# EAGLE design face_tracking_drone_onflight (EAGLE 9.3.0)
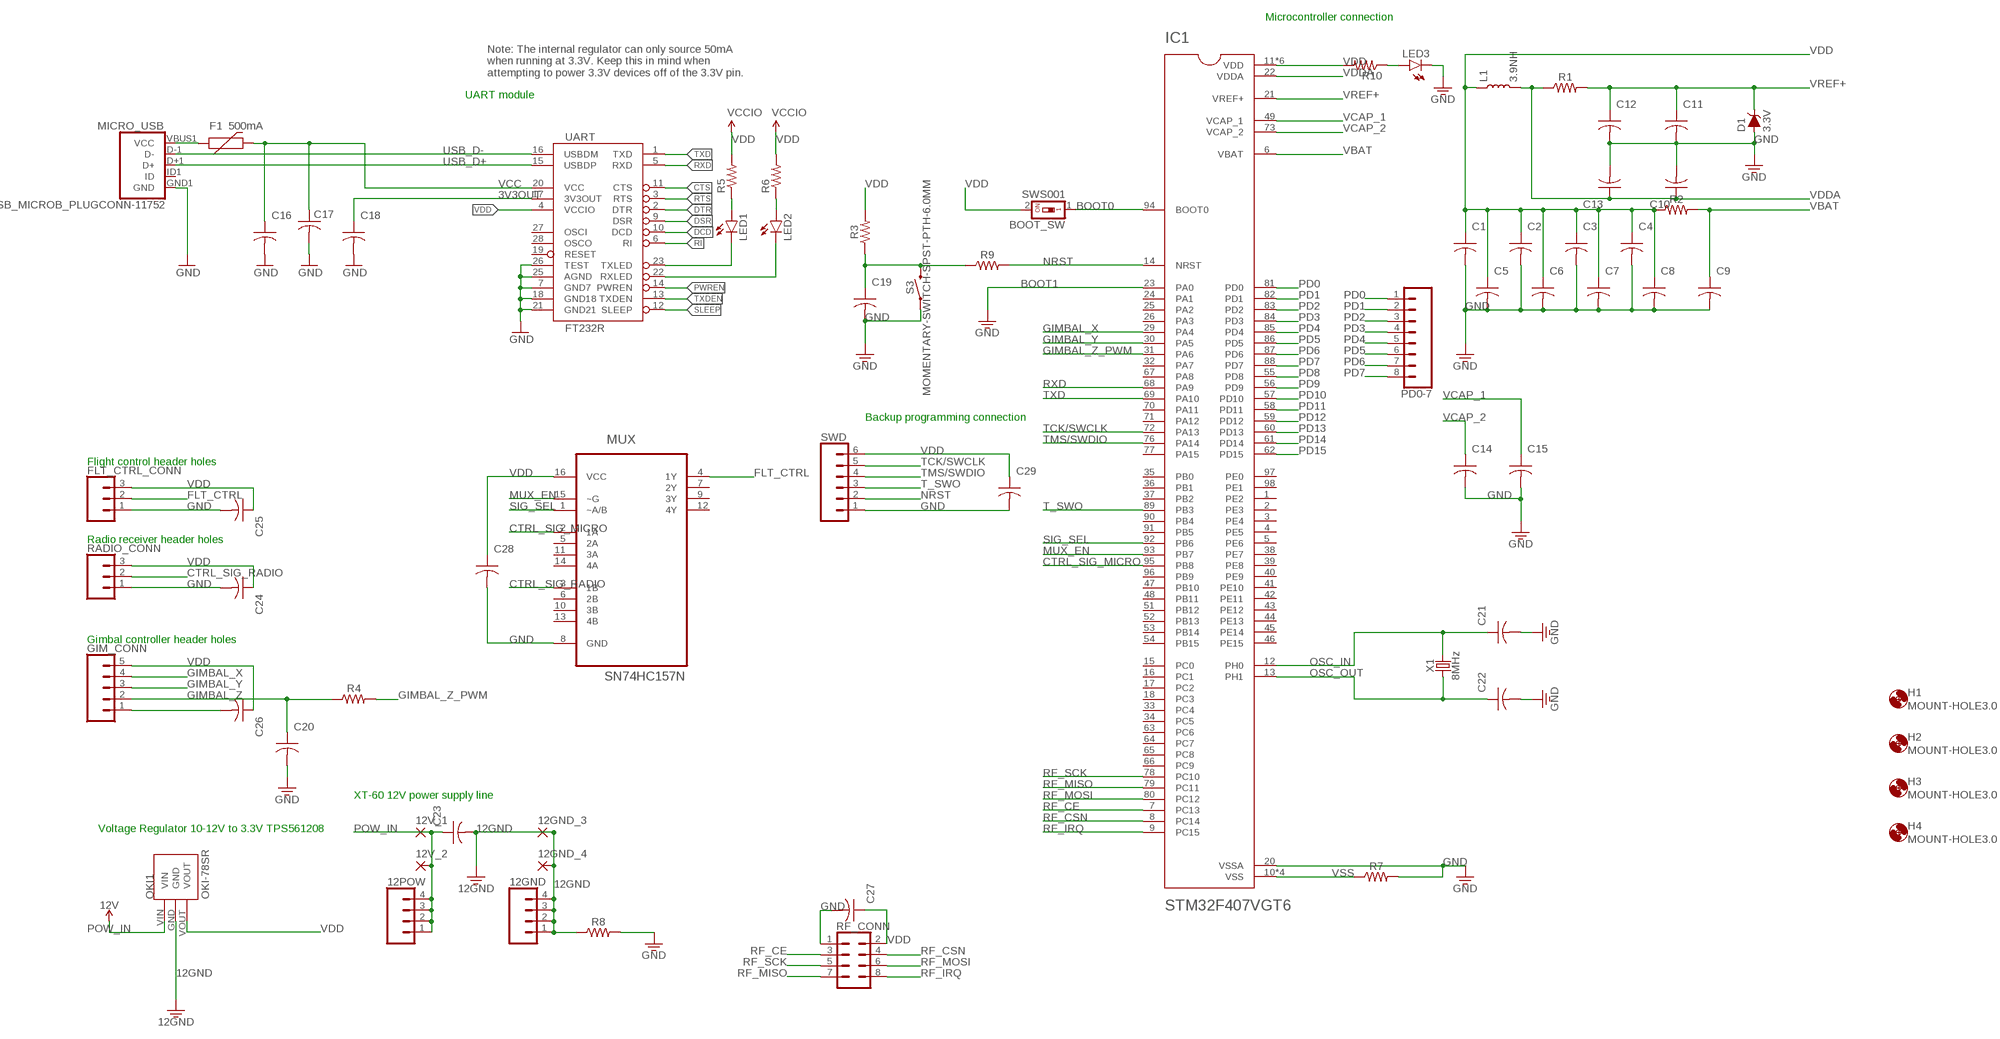
[diagram p0: schematic, sheet 1]

## Parts
12GND  CONN_04  [1X04]
12GND_3  3,81/1,4  [3,81/1,4]
12GND_4  3,81/1,4  [3,81/1,4]
12POW  CONN_04  [1X04]
12V_1  3,81/1,4  [3,81/1,4]
12V_2  3,81/1,4  [3,81/1,4]
BOOT_SW  SWS001  [SMS-001]
C1  0.1uF  C-USC0805  [C0805]
C2  0.1uF  C-USC0805  [C0805]
C3  0.1uF  C-USC0805  [C0805]
C4  0.1uF  C-USC0805  [C0805]
C5  0.1uF  C-USC0805  [C0805]
C6  0.1uF  C-USC0805  [C0805]
C7  0.1uF  C-USC0805  [C0805]
C8  0.1uF  C-USC0805  [C0805]
C9  0.1uF  C-USC0805  [C0805]
C10  0.1uF  C-USC0805  [C0805]
C11  0.1uF  C-USC0805  [C0805]
C12  1uF  C-USC0805  [C0805]
C13  1uF  C-USC0805  [C0805]
C14  2.2uF  C-USC0805  [C0805]
C15  2.2uF  C-USC0805  [C0805]
C16  0.1uF  C-USC0805  [C0805]
C17  10uF  C-USC0805  [C0805]
C18  0.1uF  C-USC0805  [C0805]
C19  2.2uF  C-USC0805  [C0805]
C20  0.1uF  C-USC0805  [C0805]
C21  20pF  C-USC0805  [C0805]
C22  20pF  C-USC0805  [C0805]
C23  0.1uF  C-USC0805  [C0805]
C24  0.1uF  C-USC0805  [C0805]
C25  0.1uF  C-USC0805  [C0805]
C26  0.1uF  C-USC0805  [C0805]
C27  0.1uF  C-USC0805  [C0805]
C28  0.1uF  C-USC0805  [C0805]
C29  0.1uF  C-USC0805  [C0805]
D1  3.3V  DIODE-ZENER-BZT52C3V6S  [SOD-323]
F1  500mA  PTCSMD  [PTC-1206]
FLT_CTRL_CONN  CONN_03  [1X03]
GIM_CONN  CONN_05  [1X05]
H1  MOUNT-HOLE3.0  [3,0]
H2  MOUNT-HOLE3.0  [3,0]
H3  MOUNT-HOLE3.0  [3,0]
H4  MOUNT-HOLE3.0  [3,0]
IC1  STM32F407VGT6  [QFP50P1600X1600X160-100N]
L1  3.9NH  INDUCTOR-0402-3.9NH  [0402]
LED1  Red  LEDCHIP-LED0805  [CHIP-LED0805]
LED2  Green  LEDCHIP-LED0805  [CHIP-LED0805]
LED3  Green  LEDCHIP-LED0805  [CHIP-LED0805]
MICRO_USB  USB_MICROB_PLUGCONN-11752  [USB-B-MICRO-SMD_V03]
MUX  SN74HC157N  [DIP254P762X508-16]
OKI1  OKI-78SR  [OKI-78SR]
PD0-7  CONN_08"  [1X08]
R1  0  R-US_M0805  [M0805]
R2  0  R-US_M0805  [M0805]
R3  10k  R-US_M0805  [M0805]
R4  100K  R-US_M0805  [M0805]
R5  330  R-US_M0805  [M0805]
R6  330  R-US_M0805  [M0805]
R7  0  R-US_M0805  [M0805]
R8  10M  R-US_M0805  [M0805]
R9  100  R-US_M0805  [M0805]
R10  330  R-US_M0805  [M0805]
RADIO_CONN  CONN_03  [1X03]
RF_CONN  CONN_04X2  [2X4]
S3  MOMENTARY-SWITCH-SPST-PTH-6.0MM  [TACTILE_SWITCH_PTH_6.0MM]
SWD  CONN_06SILK_FEMALE_PTH  [1X06]
UART  FT232R  FT232RLSSOP  [SSOP28DB]
X1  8MHz  CRYSTALPTH-HC49UV  [HC49U]

## Nets
3V3OUT [3.3power]: C18.1 UART.17(3V3OUT)
12GND [12power]: 12GND.1 12GND.2 12GND.3 12GND.4 12GND_3.1(P) 12GND_4.1(P) C23.2 OKI1.GND R8.1
BOOT0: BOOT_SW.1 IC1.94(BOOT0)
BOOT1: IC1.23(PA0) ; supply symbol labelled GND
CTRL_SIG_MICRO: IC1.95(PB8) MUX.2(1A)
CTRL_SIG_RADIO: MUX.3(1B) RADIO_CONN.2
CTS: UART.11(CTS)
DCD: UART.10(DCD)
DSR: UART.9(DSR)
DTR: UART.2(DTR)
FLT_CTRL: FLT_CTRL_CONN.2 MUX.4(1Y)
GIMBAL_X: GIM_CONN.4 IC1.29(PA4)
GIMBAL_Y: GIM_CONN.3 IC1.30(PA5)
GIMBAL_Z: C20.1 GIM_CONN.2 R4.1
GIMBAL_Z_PWM: IC1.31(PA6) R4.2
GND [3.3power]: C1.2 C2.2 C3.2 C4.2 C5.2 C6.2 C7.2 C8.2 C9.2 C10.2 C11.2 C12.2 C13.2 C14.2 C15.2 C16.2 C17.2 C18.2 C19.2 C20.2 C21.2 C22.2 C24.2 C25.2 C26.2 C27.2 C28.2 C29.2 D1.A FLT_CTRL_CONN.1 GIM_CONN.1 IC1.20(VSSA) LED3.C MICRO_USB.GND1(GND) MUX.8(GND) R7.2 R8.2 RADIO_CONN.1 RF_CONN.1 S3.1 SWD.1 UART.7(GND7) UART.18(GND18) UART.21(GND21) UART.25(AGND) UART.26(TEST)
MUX_EN: IC1.93(PB7) MUX.15(~G)
N$1: LED1.A R5.1
N$2: LED3.A R10.1
N$4: LED2.A R6.1
N$5: F1.1 MICRO_USB.VBUS1(VCC)
N$6: C19.1 R3.1 R9.1 S3.3
NRST: IC1.14(NRST) R9.2 SWD.2
OSC_IN: C21.1 IC1.12(PH0) X1.2
OSC_OUT: C22.1 IC1.13(PH1) X1.1
PD0: IC1.81(PD0) PD0-7.1
PD1: IC1.82(PD1) PD0-7.2
PD2: IC1.83(PD2) PD0-7.3
PD3: IC1.84(PD3) PD0-7.4
PD4: IC1.85(PD4) PD0-7.5
PD5: IC1.86(PD5) PD0-7.6
PD6: IC1.87(PD6) PD0-7.7
PD7: IC1.88(PD7) PD0-7.8
PD8: IC1.55(PD8)
PD9: IC1.56(PD9)
PD10: IC1.57(PD10)
PD11: IC1.58(PD11)
PD12: IC1.59(PD12)
PD13: IC1.60(PD13)
PD14: IC1.61(PD14)
PD15: IC1.62(PD15)
POW_IN [12power]: 12POW.1 12POW.2 12POW.3 12POW.4 12V_1.1(P) 12V_2.1(P) C23.1 OKI1.VIN ; supply symbol labelled 12V
PWREN: UART.14(PWREN)
RF_CE: IC1.7(PC13) RF_CONN.3
RF_CSN: IC1.8(PC14) RF_CONN.4
RF_IRQ: IC1.9(PC15) RF_CONN.8
RF_MISO: IC1.79(PC11) RF_CONN.7
RF_MOSI: IC1.80(PC12) RF_CONN.6
RF_SCK: IC1.78(PC10) RF_CONN.5
RI: UART.6(RI)
RTS: UART.3(RTS)
RXD: IC1.68(PA9) UART.5(RXD)
RXLED: LED2.C UART.22(RXLED)
SIG_SEL: IC1.92(PB6) MUX.1(~A/B)
SLEEP: UART.12(SLEEP)
T_SWO: IC1.89(PB3) SWD.3
TCK/SWCLK: IC1.72(PA13) SWD.5
TMS/SWDIO: IC1.76(PA14) SWD.4
TXD: IC1.69(PA10) UART.1(TXD)
TXDEN: UART.13(TXDEN)
TXLED: LED1.C UART.23(TXLED)
USB_D+: MICRO_USB.D+1(D+) UART.15(USBDP)
USB_D-: MICRO_USB.D-1(D-) UART.16(USBDM)
VBAT: C9.1 IC1.6(VBAT) R2.2
VCAP_1: C15.1 IC1.49(VCAP_1)
VCAP_2: C14.1 IC1.73(VCAP_2)
VCC [3.3power]: C16.1 C17.1 F1.2 UART.20(VCC)
VDD [3.3power]: BOOT_SW.2 C1.1 C2.1 C3.1 C4.1 C5.1 C6.1 C7.1 C8.1 C24.1 C25.1 C26.1 C27.1 C28.1 C29.1 FLT_CTRL_CONN.3 GIM_CONN.5 IC1.11(VDD) IC1.19(VDD) IC1.28(VDD) IC1.50(VDD) IC1.75(VDD) IC1.100(VDD) L1.1 MUX.16(VCC) OKI1.VOUT R2.1 R3.2 R5.2 R6.2 R10.2 RADIO_CONN.3 RF_CONN.2 SWD.6 UART.4(VCCIO) ; supply symbol labelled VCCIO
VDDA: C10.1 C13.1 IC1.22(VDDA) L1.2 R1.1
VREF+: C11.1 C12.1 D1.C IC1.21(VREF+) R1.2
VSS: IC1.10(VSS) IC1.27(VSS) IC1.74(VSS) IC1.99(VSS) R7.1
Unconnected: IC1.1(PE2) IC1.2(PE3) IC1.3(PE4) IC1.4(PE5) IC1.5(PE6) IC1.15(PC0) IC1.16(PC1) IC1.17(PC2) IC1.18(PC3) IC1.24(PA1) IC1.25(PA2) IC1.26(PA3) IC1.32(PA7) IC1.33(PC4) IC1.34(PC5) IC1.35(PB0) IC1.36(PB1) IC1.37(PB2) IC1.38(PE7) IC1.39(PE8) IC1.40(PE9) IC1.41(PE10) IC1.42(PE11) IC1.43(PE12) IC1.44(PE13) IC1.45(PE14) IC1.46(PE15) IC1.47(PB10) IC1.48(PB11) IC1.51(PB12) IC1.52(PB13) IC1.53(PB14) IC1.54(PB15) IC1.63(PC6) IC1.64(PC7) IC1.65(PC8) IC1.66(PC9) IC1.67(PA8) IC1.70(PA11) IC1.71(PA12) IC1.77(PA15) IC1.90(PB4) IC1.91(PB5) IC1.96(PB9) IC1.97(PE0) IC1.98(PE1) MICRO_USB.ID1(ID) MUX.5(2A) MUX.6(2B) MUX.7(2Y) MUX.9(3Y) MUX.10(3B) MUX.11(3A) MUX.12(4Y) MUX.13(4B) MUX.14(4A) UART.19(RESET) UART.27(OSCI) UART.28(OSCO)

## Notes on the sheet
- Microcontroller connection
- Note: The internal regulator can only source 50mA
  when running at 3.3V. Keep this in mind when
  attempting to power 3.3V devices off of the 3.3V pin.
- UART module
- Backup programming connection
- Flight control header holes
- Radio receiver header holes
- Gimbal controller header holes
- XT-60 12V power supply line
- Voltage Regulator 10-12V to 3.3V TPS561208

## Library data of the parts
12GND 12POW = SparkFun-Connectors:CONN_04: Multi connection point. Often used as Generic Header-pin footprint for 0.1 inch spaced/style header connections On any of the 0.1 inch spaced packages, you can populate with these: Break Away Headers - Straight <https://www.sparkfun.com/products/116> (PRT-00116) Break Away Male Headers - Right Angle <https://www.sparkfun.com/products/553> (PRT-00553) Female Headers <https://www.sparkfun.com/products/115> (PRT-00115) Break Away Headers - Machine Pin <https://www.sparkfun.com/products/117> (PRT-00117) Break Away Female Headers - Swiss Machine Pin <https://www.sparkfun.com/products/743> (PRT-00743) For SCREWTERMINALS and SPRING TERMINALS visit here: Screw Terimnals on SparkFun.com <https://www.sparkfun.com/search/results?term=Screw+Terminals> (5mm/3.5mm/2.54mm spacing) This device is also useful as a general connection point to wire up your design to another part of your project. Our various solder wires solder well into these plated through hole pads. Hook-Up Wire - Assortment (Stranded, 22 AWG) <https://www.sparkfun.com/products/11375> (PRT-11375) Hook-Up Wire - Assortment (Solid Core, 22 AWG) <https://www.sparkfun.com/products/11367> (PRT-11367) View the entire wire category on our website here <https://www.sparkfun.com/categories/141> Special notes: Molex polarized connector foot print use with SKU : PRT-08231 with associated crimp pins and housings. 1MM SMD Version SKU: PRT-10208; PROD_ID: CONN-09696
12GND_3 12GND_4 12V_1 12V_2 = wirepad:3,81/1,4: THROUGH-HOLE PAD
BOOT_SW = smd-special:SWS001: SMD Dip Switch 1 pol.
C1-C29 = resistor:C-US: CAPACITOR, American symbol
D1 = SparkFun-DiscreteSemi:DIODE-ZENER: Zener Diode A Zener diode allows current to flow from its anode to its cathode like a normal semiconductor diode, but it also permits current to flow in the reverse direction when its "Zener voltage" is reached. - WIkipedia; PROD_ID: DIO-08199; VALUE: 3.6V
F1 = SparkFun:PTC: Resettable Fuse PTC Resettable Fuse. Spark Fun Electronics SKU : COM-08357
FLT_CTRL_CONN RADIO_CONN = SparkFun-Connectors:CONN_03: Multi connection point. Often used as Generic Header-pin footprint for 0.1 inch spaced/style header connections On any of the 0.1 inch spaced packages, you can populate with these: Break Away Headers - Straight <https://www.sparkfun.com/products/116> (PRT-00116) Break Away Male Headers - Right Angle <https://www.sparkfun.com/products/553> (PRT-00553) Female Headers <https://www.sparkfun.com/products/115> (PRT-00115) Break Away Headers - Machine Pin <https://www.sparkfun.com/products/117> (PRT-00117) Break Away Female Headers - Swiss Machine Pin <https://www.sparkfun.com/products/743> (PRT-00743) Stackable Header - 3 Pin (Female, 0.1") <https://www.sparkfun.com/products/13875> (PRT-13875) For SCREWTERMINALS and SPRING TERMINALS visit here: Screw Terimnals on SparkFun.com <https://www.sparkfun.com/search/results?term=Screw+Terminals> (5mm/3.5mm/2.54mm spacing) This device is also useful as a general connection point to wire up your design to another part of your project. Our various solder wires solder well into these plated through hole pads. Hook-Up Wire - Assortment (Stranded, 22 AWG) <https://www.sparkfun.com/products/11375> (PRT-11375) Hook-Up Wire - Assortment (Solid Core, 22 AWG) <https://www.sparkfun.com/products/11367> (PRT-11367) View the entire wire category on our website here <https://www.sparkfun.com/categories/141> Special notes: Molex polarized connector foot print use with SKU : PRT-08232 with associated crimp pins and housings.
GIM_CONN = SparkFun-Connectors:CONN_05: Multi connection point. Often used as Generic Header-pin footprint for 0.1 inch spaced/style header connections On any of the 0.1 inch spaced packages, you can populate with these: Break Away Headers - Straight <https://www.sparkfun.com/products/116> (PRT-00116) Break Away Male Headers - Right Angle <https://www.sparkfun.com/products/553> (PRT-00553) Female Headers <https://www.sparkfun.com/products/115> (PRT-00115) Break Away Headers - Machine Pin <https://www.sparkfun.com/products/117> (PRT-00117) Break Away Female Headers - Swiss Machine Pin <https://www.sparkfun.com/products/743> (PRT-00743) For SCREWTERMINALS and SPRING TERMINALS visit here: Screw Terimnals on SparkFun.com <https://www.sparkfun.com/search/results?term=Screw+Terminals> (5mm/3.5mm/2.54mm spacing) This device is also useful as a general connection point to wire up your design to another part of your project. Our various solder wires solder well into these plated through hole pads. Hook-Up Wire - Assortment (Stranded, 22 AWG) <https://www.sparkfun.com/products/11375> (PRT-11375) Hook-Up Wire - Assortment (Solid Core, 22 AWG) <https://www.sparkfun.com/products/11367> (PRT-11367) View the entire wire category on our website here <https://www.sparkfun.com/categories/141> Special notes: Molex polarized connector foot print use with SKU : PRT-08231 with associated crimp pins and housings. 1MM SMD Version SKU: PRT-10208
H1-H4 = holes:MOUNT-HOLE: MOUNTING HOLE with drill center marker
IC1 = STM32F407VGT6:STM32F407VGT6: STM32 Series 32-bit 1 MB Flash 192 kB RAM ARM Based Microcontroller - LQFP-100; AVAILABILITY: Unavailable; DESCRIPTION: STM32 Series 32-bit 1 MB Flash 192 kB RAM ARM Based Microcontroller - LQFP-100; MF: STMicroelectronics; MP: STM32F407VGT6; PACKAGE: LQFP-100 STMicroelectronics; PRICE: None
L1 = SparkFun-Coils:INDUCTOR: Inductors Resist changes in electrical current. Basically a coil of wire. SparkFun Products: SparkFun Load Cell Amplifier - HX711 <https://www.sparkfun.com/products/13879> IOIO-OTG - V2.2 <https://www.sparkfun.com/products/13613>; PROD_ID: NDUC-13457
LED1-LED3 = led:LED: LED OSRAM: - CHIPLED LG R971, LG N971, LY N971, LG Q971, LY Q971, LO R971, LY R971 LH N974, LH R974 LS Q976, LO Q976, LY Q976 LO Q996 - Hyper CHIPLED LW Q18S LB Q993, LB Q99A, LB R99A - SideLED LS A670, LO A670, LY A670, LG A670, LP A670 LB A673, LV A673, LT A673, LW A673 LH A674 LY A675 LS A676, LA A676, LO A676, LY A676, LW A676 LS A679, LY A679, LG A679 - Hyper Micro SIDELED® LS Y876, LA Y876, LO Y876, LY Y876 LT Y87S - SmartLED LW L88C, LW L88S LB L89C, LB L89S, LG L890 LS L89K, LO L89K, LY L89K LS L896, LA L896, LO L896, LY L896 - TOPLED LS T670, LO T670, LY T670, LG T670, LP T670 LSG T670, LSP T670, LSY T670, LOP T670, LYG T670 LG T671, LOG T671, LSG T671 LB T673, LV T673, LT T673, LW T673 LH T674 LS T676, LA T676, LO T676, LY T676, LB T676, LH T676, LSB T676, LW T676 LB T67C, LV T67C, LT T67C, LS T67K, LO T67K, LY T67K, LW E67C LS E67B, LA E67B, LO E67B, LY E67B, LB E67C, LV E67C, LT E67C LW T67C LS T679, LY T679, LG T679 LS T770, LO T770, LY T770, LG T770, LP T770 LB T773, LV T773, LT T773, LW T773 LH T774 LS E675, LA E675, LY E675, LS T675 LS T776, LA T776, LO T776, LY T776, LB T776 LHGB T686 LT T68C, LB T68C - Hyper Mini TOPLED® LB M676 - Mini TOPLED Santana® LG M470 LS M47K, LO M47K, LY M47K Source: http://www.osram.convergy.de LUXEON: - LUMILED® LXK2-PW12-R00, LXK2-PW12-S00, LXK2-PW14-U00, LXK2-PW14-V00 LXK2-PM12-R00, LXK2-PM12-S00, LXK2-PM14-U00 LXK2-PE12-Q00, LXK2-PE12-R00, LXK2-PE12-S00, LXK2-PE14-T00, LXK2-PE14-U00 LXK2-PB12-K00, LXK2-PB12-L00, LXK2-PB12-M00, LXK2-PB14-N00, LXK2-PB14-P00, LXK2-PB14-Q00 LXK2-PR12-L00, LXK2-PR12-M00, LXK2-PR14-Q00, LXK2-PR14-R00 LXK2-PD12-Q00, LXK2-PD12-R00, LXK2-PD12-S00 LXK2-PH12-R00, LXK2-PH12-S00 LXK2-PL12-P00, LXK2-PL12-Q00, LXK2-PL12-R00 Source: www.luxeon.com KINGBRIGHT: KA-3528ASYC Source: www.kingbright.com
MICRO_USB = SparkFun-Connectors:USB_MICROB_PLUG: USB Micro-B Plug Comes in a variety of packages. Check out Hirose's ZX-x0 line: http://www.hirose.co.jp/cataloge_hp/e24200011.pdf; PROD_ID: CONN-11752
MUX = FaceTrackingDrone:SN74HC157N: QUAD 2 LINE TO 1 LINE DATA SELECTORS/MULTIPLEXERS; AVAILABILITY: Unavailable; DESCRIPTION: Quadruple 2-Line To 1-Line Data Selectors/Multiplexers 16-PDIP -40 to 85; MF: Texas Instruments; MP: SN74HC157N; PACKAGE: PDIP-16 Texas Instruments; PRICE: None
OKI1 = OKI-78SR 12-3.3 Voltage regulator:OKI-78SR
PD0-7 = SparkFun-Connectors:CONN_08: Multi connection point. Often used as Generic Header-pin footprint for 0.1 inch spaced/style header connections On any of the 0.1 inch spaced packages, you can populate with these: Break Away Headers - Straight <https://www.sparkfun.com/products/116> (PRT-00116) Break Away Male Headers - Right Angle <https://www.sparkfun.com/products/553> (PRT-00553) Female Headers <https://www.sparkfun.com/products/115> (PRT-00115) Break Away Headers - Machine Pin <https://www.sparkfun.com/products/117> (PRT-00117) Break Away Female Headers - Swiss Machine Pin <https://www.sparkfun.com/products/743> (PRT-00743) Arduino Stackable Header - 8 Pin <https://www.sparkfun.com/products/9279> (PRT-09279) For SCREWTERMINALS and SPRING TERMINALS visit here: Screw Terimnals on SparkFun.com <https://www.sparkfun.com/search/results?term=Screw+Terminals> (5mm/3.5mm/2.54mm spacing) This device is also useful as a general connection point to wire up your design to another part of your project. Our various solder wires solder well into these plated through hole pads. Hook-Up Wire - Assortment (Stranded, 22 AWG) <https://www.sparkfun.com/products/11375> (PRT-11375) Hook-Up Wire - Assortment (Solid Core, 22 AWG) <https://www.sparkfun.com/products/11367> (PRT-11367) View the entire wire category on our website here <https://www.sparkfun.com/categories/141> Special notes: Molex polarized connector foot print use with SKU : PRT-08231 with associated crimp pins and housings. 1MM SMD Version SKU: PRT-10208 NOTES ON THE VARIANTS LOCK and LOCK_LONGPADS... This footprint was designed to help hold the alignment of a through-hole component (i.e. 6-pin header) while soldering it into place. You may notice that each hole has been shifted either up or down by 0.005 of an inch from it's more standard position (which is a perfectly straight line). This slight alteration caused the pins (the squares in the middle) to touch the edges of the holes. Because they are alternating, it causes a "brace" to hold the component in place. 0.005 has proven to be the perfect amount of "off-center" position when using our standard breakaway headers. Although looks a little odd when you look at the bare footprint, once you have a header in there, the alteration is very hard to notice. Also,if you push a header all the way into place, it is covered up entirely on the bottom side.; PROD_ID: CONN-08438
R1-R10 = rcl:R-US_: RESISTOR, American symbol; SPICEPREFIX: R
RF_CONN = SparkFun-Connectors:CONN_04X2: Multi connection point. Often used as Generic Header-pin footprint for 0.1 inch spaced/style header connections On any of the 0.1 inch spaced packages, you can populate with these: Break Away Headers - Straight <https://www.sparkfun.com/products/116> (PRT-00116) Break Away Male Headers - Right Angle <https://www.sparkfun.com/products/553> (PRT-00553) Female Headers <https://www.sparkfun.com/products/115> (PRT-00115) Break Away Headers - Machine Pin <https://www.sparkfun.com/products/117> (PRT-00117) Break Away Female Headers - Swiss Machine Pin <https://www.sparkfun.com/products/743> (PRT-00743)
S3 = SparkFun-Switches:MOMENTARY-SWITCH-SPST: Momentary Switch (Pushbutton) - SPST Normally-open (NO) SPST momentary switches (buttons, pushbuttons). Variants PTH-12MM - 12mm square, through-hole Momentary Pushbutton Switch - 12mm Square <https://www.sparkfun.com/products/9190> (COM-09190) PTH-6.0MM, PTH-6.0MM-KIT - 6.0mm square, through-hole Mini Pushbutton Switch <https://www.sparkfun.com/products/97> (COM-00097) KIT package intended for soldering kit's - only one side of pads' copper is exposed. PTH-RIGHT-ANGLE-KIT - Right-angle, through-hole Right Angle Tactile Button <https://www.sparkfun.com/products/10791> - Used on SparkFun BigTime Watch Kit <https://www.sparkfun.com/products/11734> SMD-12MM - 12mm square, surface-mount Tactile Button - SMD (12mm) <https://www.sparkfun.com/products/12993> (COM-12993) Used on SparkFun PicoBoard <https://www.sparkfun.com/products/11888> SMD-4.5MM - 4.5mm Square Trackball Switch Used on SparkFun Blackberry Trackballer Breakout <https://www.sparkfun.com/products/13169> SMD-4.6MMX2.8MM - 4.60mm x 2.80mm, surface mount Used on SparkFun SAMD21 Mini Breakout <https://www.sparkfun.com/products/13664> SMD-5.2MM, SMD-5.2-REDUNDANT - 5.2mm square, surface-mount Mini Pushbutton Switch - SMD <https://www.sparkfun.com/products/8720> (COM-08720) Used on Arduino Pro Mini <https://www.sparkfun.com/products/11114> REDUNDANT package connects both switch circuits together SMD-6.0X3.5MM - 6.0 x 3.5mm, surface mount Momentary Reset Switch SMD <https://www.sparkfun.com/products/8229> (COM-08229) SMD-6.2MM-TALL - 6.2mm square, surface mount Tactile Button - SMD (6mm) <https://www.sparkfun.com/products/12992> Used on SparkFun Digital Sandbox <https://www.sparkfun.com/products/12651> SMD-RIGHT-ANGLE - Right-angle, surface mount Used on SparkFun Block for Intel® Edison - Arduino <https://www.sparkfun.com/products/13036>; PROD_ID: SWCH-08441; SF_SKU: COM-00097
SWD = SparkFun-Connectors:CONN_06: Multi connection point. Often used as Generic Header-pin footprint for 0.1 inch spaced/style header connections On any of the 0.1 inch spaced packages, you can populate with these: Break Away Headers - Straight <https://www.sparkfun.com/products/116> (PRT-00116) Break Away Male Headers - Right Angle <https://www.sparkfun.com/products/553> (PRT-00553) Female Headers <https://www.sparkfun.com/products/115> (PRT-00115) Break Away Headers - Machine Pin <https://www.sparkfun.com/products/117> (PRT-00117) Break Away Female Headers - Swiss Machine Pin <https://www.sparkfun.com/products/743> (PRT-00743) Arduino Stackable Header - 6 Pin <https://www.sparkfun.com/products/9280> (PRT-09280) For SCREWTERMINALS and SPRING TERMINALS visit here: Screw Terimnals on SparkFun.com <https://www.sparkfun.com/search/results?term=Screw+Terminals> (5mm/3.5mm/2.54mm spacing) This device is also useful as a general connection point to wire up your design to another part of your project. Our various solder wires solder well into these plated through hole pads. Hook-Up Wire - Assortment (Stranded, 22 AWG) <https://www.sparkfun.com/products/11375> (PRT-11375) Hook-Up Wire - Assortment (Solid Core, 22 AWG) <https://www.sparkfun.com/products/11367> (PRT-11367) View the entire wire category on our website here <https://www.sparkfun.com/categories/141>; PROD_ID: CONN-08437
UART = SparkFun:FT232RL: USB UART FT232RL 4th Generation USB UART (USB <-> Serial) Controller. Spark Fun Electronics SKU : COM-00650
X1 = SparkFun-Clocks:CRYSTAL: Crystals (Generic) These are passive quartz crystals, which can be used as a clock source for a microcontroller. Crystal's are two-terminal devices. They require external "load" capacitors to generate an oscillating signal.

## Net classes
1 3.3power: width 0.254 mm
2 12power: width 0.508 mm

## Board
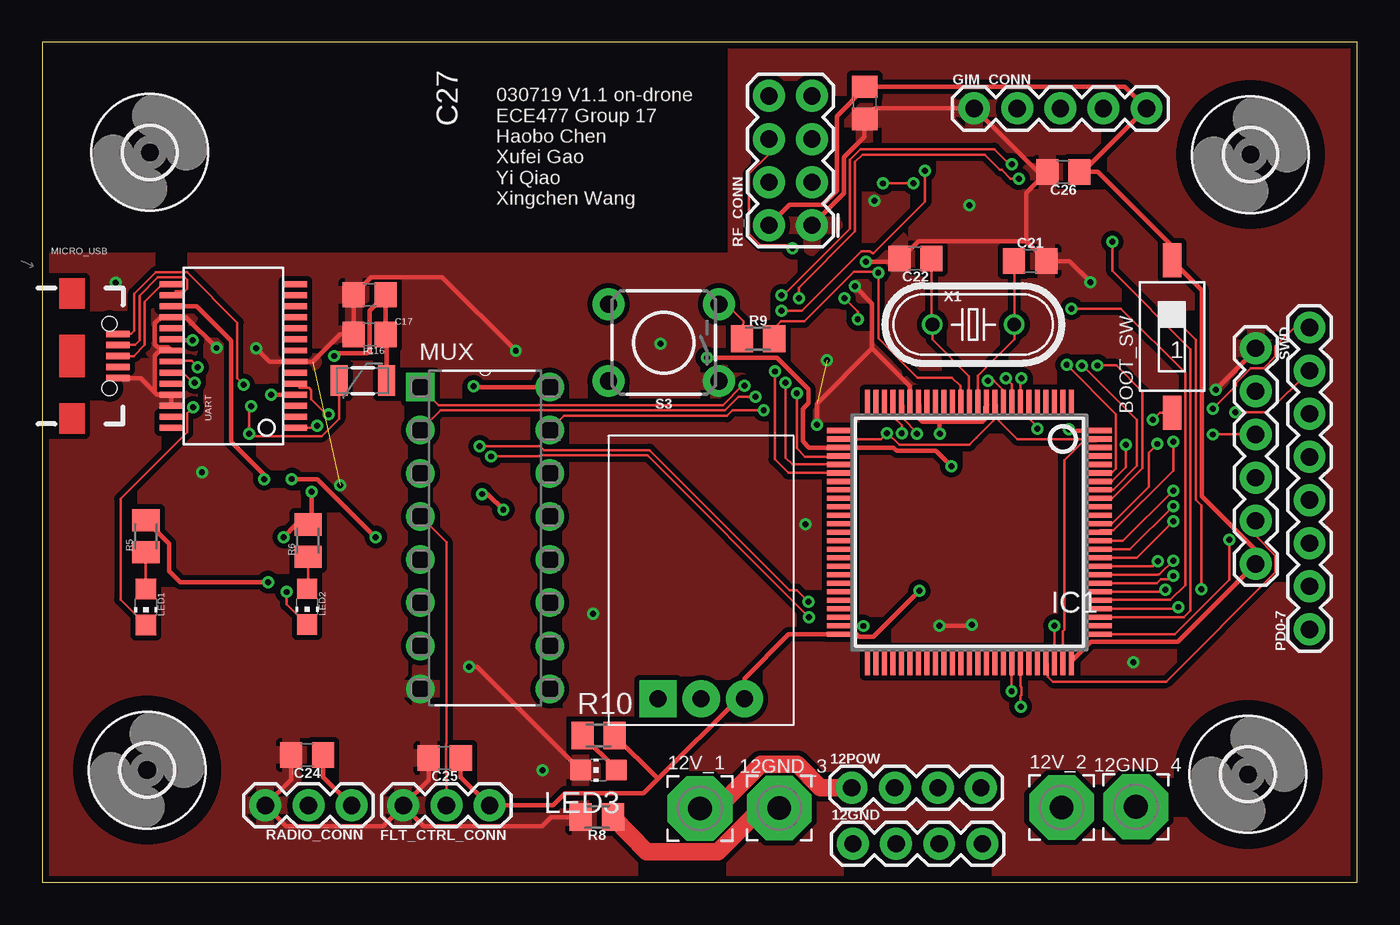
[diagram p1: board, top side]
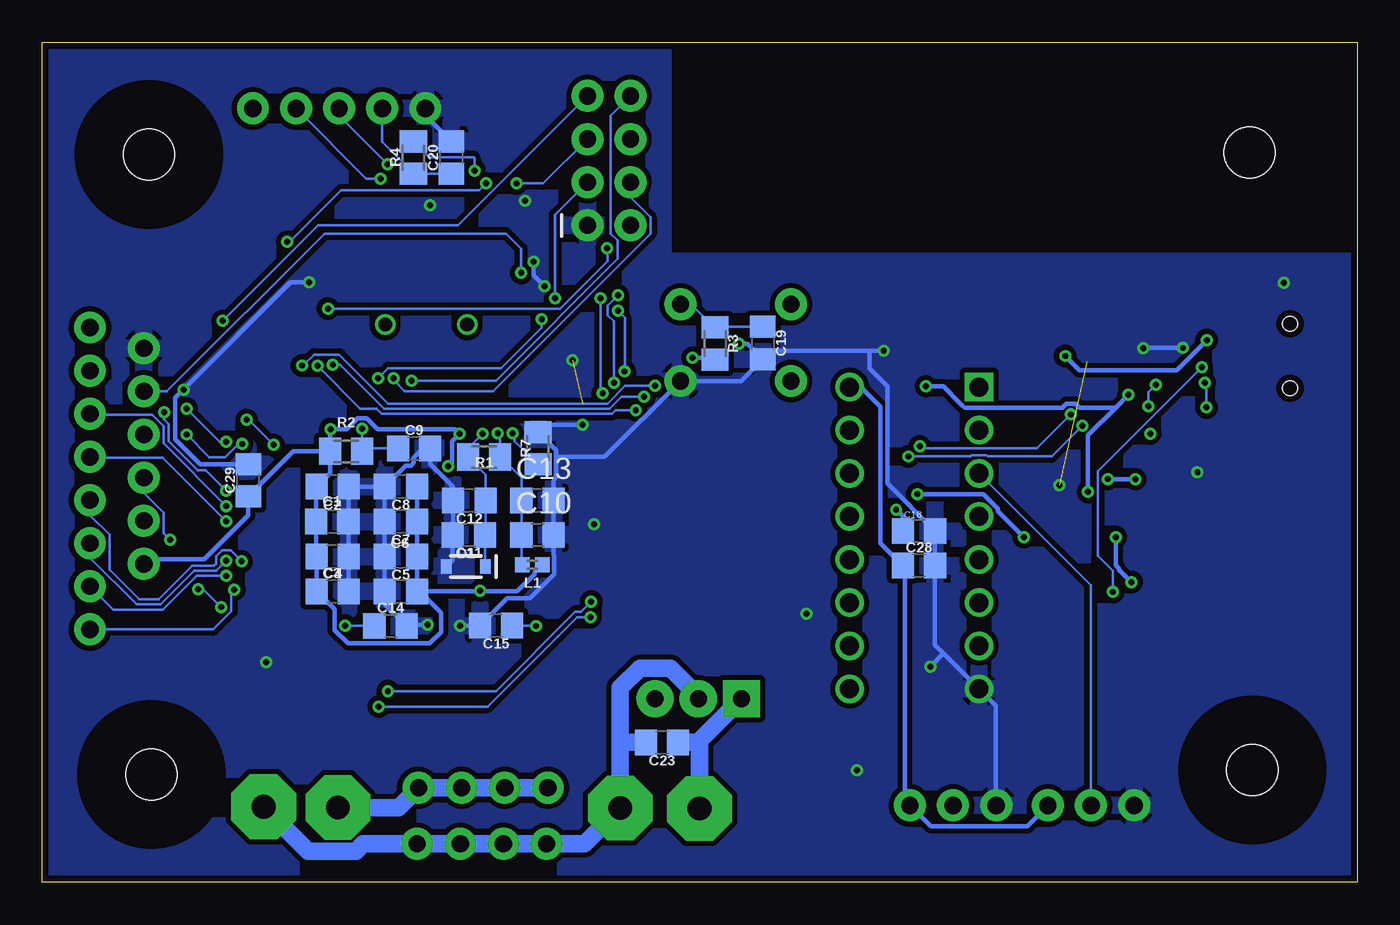
[diagram p2: board, bottom side, seen from below]

Size 77.45 x 49.45 mm. Coordinates in mm from the lower left corner, seen from the top.
Outline: 0,0 77.45,0 77.45,49.45 0,49.45 0,0
Copper layers (1*16): Top 0.0356mm / dielectric 1.5011mm / Bottom 0.0356mm
Design rules "ECE_Senior_Design *": minimum track width 6mil, minimum drill 13mil, track to track 6mil, track to pad 6mil, pad to pad 6mil, via to via 6mil, smd to smd 6mil, copper to edge 15mil, drill to drill 8mil, minimum pad ring 7mil, minimum via ring 7mil, stop-mask expansion 3mil, vias tented up to drill 0mil, thermal gap 10mil

### Footprints (pad centres in the part's own frame; a part is rotated, then mirrored left to right if it is on the bottom)
1X04 = drill 1.016 pad 1.88: 1 0,0; 2 2.54,0; 3 5.08,0; 4 7.62,0
3,81/1,4 = drill 1.397 pad 3.81 octagon: 1 0,0
SMS-001 = smd 1.092 x 2.007: 1 0,-4.496; 2 0,4.496
C0805 = smd 1.3 x 1.5: 1 -0.95,0; 2 0.95,0
SOD-323 = smd 0.63 x 0.83: A 1.15,0; C -1.15,0
PTC-1206 = smd 1 x 1.8: 1 -1.4,0; 2 1.4,0
1X03 = drill 1.016 pad 1.88: 1 0,0; 2 2.54,0; 3 5.08,0
1X05 = drill 1.016 pad 1.88: 1 0,0; 2 2.54,0; 3 5.08,0; 4 7.62,0; 5 10.16,0
3,0 = hole 3: 0,0
QFP50P1600X1600X160-100N = smd 0.3 x 1.6: 1 -6,-7.6; 2 -5.5,-7.6; 3 -5,-7.6; 4 -4.5,-7.6; 5 -4,-7.6; 6 -3.5,-7.6; 7 -3,-7.6; 8 -2.5,-7.6; 9 -2,-7.6; 10 -1.5,-7.6; 11 -1,-7.6; 12 -0.5,-7.6; 13 0,-7.6; 14 0.5,-7.6; 15 1,-7.6; 16 1.5,-7.6; 17 2,-7.6; 18 2.5,-7.6; 19 3,-7.6; 20 3.5,-7.6; 21 4,-7.6; 22 4.5,-7.6; 23 5,-7.6; 24 5.5,-7.6; 25 6,-7.6; 51 6,7.6; 52 5.5,7.6; 53 5,7.6; 54 4.5,7.6; 55 4,7.6; 56 3.5,7.6; 57 3,7.6; 58 2.5,7.6; 59 2,7.6; 60 1.5,7.6; 61 1,7.6; 62 0.5,7.6; 63 0,7.6; 64 -0.5,7.6; 65 -1,7.6; 66 -1.5,7.6; 67 -2,7.6; 68 -2.5,7.6; 69 -3,7.6; 70 -3.5,7.6; 71 -4,7.6; 72 -4.5,7.6; 73 -5,7.6; 74 -5.5,7.6; 75 -6,7.6 | smd 1.6 x 0.3: 26 7.6,-6; 27 7.6,-5.5; 28 7.6,-5; 29 7.6,-4.5; 30 7.6,-4; 31 7.6,-3.5; 32 7.6,-3; 33 7.6,-2.5; 34 7.6,-2; 35 7.6,-1.5; 36 7.6,-1; 37 7.6,-0.5; 38 7.6,0; 39 7.6,0.5; 40 7.6,1; 41 7.6,1.5; 42 7.6,2; 43 7.6,2.5; 44 7.6,3; 45 7.6,3.5; 46 7.6,4; 47 7.6,4.5; 48 7.6,5; 49 7.6,5.5; 50 7.6,6; 76 -7.6,6; 77 -7.6,5.5; 78 -7.6,5; 79 -7.6,4.5; 80 -7.6,4; 81 -7.6,3.5; 82 -7.6,3; 83 -7.6,2.5; 84 -7.6,2; 85 -7.6,1.5; 86 -7.6,1; 87 -7.6,0.5; 88 -7.6,0; 89 -7.6,-0.5; 90 -7.6,-1; 91 -7.6,-1.5; 92 -7.6,-2; 93 -7.6,-2.5; 94 -7.6,-3; 95 -7.6,-3.5; 96 -7.6,-4; 97 -7.6,-4.5; 98 -7.6,-5; 99 -7.6,-5.5; 100 -7.6,-6
0402 = smd 0.85 x 0.9: 1 -0.58,0; 2 0.58,0
CHIP-LED0805 = smd 1.2 x 1.2: A 0,-1.05; C 0,1.05
USB-B-MICRO-SMD_V03 = smd 1.4 x 0.4: D+1 2.7,0; D-1 2.7,0.65; GND1 2.7,-1.3; ID1 2.7,-0.65; VBUS1 2.7,1.3 | hole 0.85: 2.2,1.9; 2.2,-1.9
DIP254P762X508-16 = drill 1.118 square: 1 -7.62,17.78 | drill 1.118: 2 -7.62,15.24; 3 -7.62,12.7; 4 -7.62,10.16; 5 -7.62,7.62; 6 -7.62,5.08; 7 -7.62,2.54; 8 -7.62,0; 9 0,0; 10 0,2.54; 11 0,5.08; 12 0,7.62; 13 0,10.16; 14 0,12.7; 15 0,15.24; 16 0,17.78
OKI-78SR = drill 1 pad 2.184: GND 5.461,1.524; VOUT 8.001,1.524 | drill 1 pad 2.184 square: VIN 2.921,1.524
1X08 = drill 1.016 pad 1.88: 1 0,0; 2 2.54,0; 3 5.08,0; 4 7.62,0; 5 10.16,0; 6 12.7,0; 7 15.24,0; 8 17.78,0
M0805 = smd 1.3 x 1.6: 1 -0.95,0; 2 0.95,0
2X4 = drill 1.016 pad 1.88: 1 -3.81,-1.27; 2 -3.81,1.27; 3 -1.27,-1.27; 4 -1.27,1.27; 5 1.27,-1.27; 6 1.27,1.27; 7 3.81,-1.27; 8 3.81,1.27
TACTILE_SWITCH_PTH_6.0MM = drill 1.016 pad 1.88: 1 -3.251,2.261; 2 3.251,2.261; 3 -3.251,-2.261; 4 3.251,-2.261
1X06 = drill 1.016 pad 1.88: 1 0,0; 2 2.54,0; 3 5.08,0; 4 7.62,0; 5 10.16,0; 6 12.7,0
SSOP28DB = smd 0.348 x 1.397: 1 -4.225,-3.656; 2 -3.575,-3.656; 3 -2.925,-3.656; 4 -2.275,-3.656; 5 -1.625,-3.656; 6 -0.975,-3.656; 7 -0.325,-3.656; 8 0.325,-3.656; 9 0.975,-3.656; 10 1.625,-3.656; 11 2.275,-3.656; 12 2.925,-3.656; 13 3.575,-3.656; 14 4.225,-3.656; 15 4.225,3.656; 16 3.575,3.656; 17 2.925,3.656; 18 2.275,3.656; 19 1.625,3.656; 20 0.975,3.656; 21 0.325,3.656; 22 -0.325,3.656; 23 -0.975,3.656; 24 -1.625,3.656; 25 -2.275,3.656; 26 -2.925,3.656; 27 -3.575,3.656; 28 -4.225,3.656
HC49U = drill 0.813: 1 -2.413,0; 2 2.413,0

### Placement (x,y rotation side)
12GND  47.75,2.26 0 top
12GND_3  43.41,4.37 0 top
12GND_4  64.41,4.45 0 top
12POW  47.68,5.56 0 top
12V_1  38.73,4.34 0 top
12V_2  60.05,4.39 0 top
BOOT_SW  66.55,32.13 0 top
C1  60.35,23.29 0 bottom
C2  60.38,21.23 0 bottom
C3  60.35,19.18 0 bottom
C4  60.35,17.12 0 bottom
C5  56.34,17.12 180 bottom
C6  56.34,19.18 180 bottom
C7  56.34,21.23 180 bottom
C8  56.34,23.29 180 bottom
C9  55.55,25.55 0 bottom
C10  48.29,20.45 0 bottom
C11  52.32,20.45 180 bottom
C12  52.3,22.48 180 bottom
C13  48.29,22.48 0 bottom
C14  56.95,15.09 0 bottom
C15  50.72,15.11 180 bottom
C16  19.28,32.26 180 top
C17  19.28,34.59 180 top
C18  25.81,20.68 0 bottom
C19  35,31.75 270 bottom
C20  53.37,42.67 90 bottom
C21  58.19,36.58 0 top
C22  51.44,36.73 180 top
C23  40.94,8.23 180 bottom
C24  15.6,7.49 180 top
C25  23.7,7.32 180 top
C26  60.15,41.83 180 top
C27  48.44,45.9 270 top
C28  25.81,18.64 0 bottom
C29  65.33,23.67 90 bottom
D1  52.5,18.59 180 bottom
F1  18.87,29.54 0 top
FLT_CTRL_CONN  21.26,4.52 0 top
GIM_CONN  54.89,45.57 0 top
H1  6.17,6.6 0 top
H2  6.32,42.98 0 top
H3  71.17,42.85 0 top
H4  71.02,6.35 0 top
IC1  54.61,20.6 180 top
L1  48.59,18.69 180 bottom
LED1  6.1,16.21 180 top
LED2  15.6,16.23 180 top
LED3  32.77,6.6 90 top
MICRO_USB  1.75,30.99 0 top
MUX  29.9,11.38 0 top
OKI1  33.35,9.27 0 top
PD0-7  74.65,14.88 90 top
R1  51.44,25.04 180 bottom
R2  59.56,25.37 0 bottom
R3  37.82,31.72 270 bottom
R4  55.6,42.67 90 bottom
R5  6.1,20.37 90 top
R6  15.65,20.12 90 top
R7  48.26,25.55 90 bottom
R8  32.66,3.84 180 top
R9  42.16,32 0 top
R10  32.77,8.64 0 top
RADIO_CONN  13.13,4.52 0 top
RF_CONN  44.07,42.49 90 top
S3  36.6,31.78 180 top
SWD  71.48,31.45 270 top
UART  11.25,30.99 90 top
X1  54.84,32.84 0 top

### Tracks (layer width: path | path; a pad name or v marks a point on that pad's centre or on a via)
3V3OUT  (via drill 0.35)
  Top 0.254: UART.17 9.1,33.91 11.13,31.88 11.13,25.94 13.06,24 v13.06,23.73 | v19.64,20.32 19.61,20.32 16.19,23.74 v14.69,23.74 | v25.91,22.86 26.24,22.86 v27.15,21.95
  Bottom 0.254: v13.06,23.73 v14.68,23.73 v14.69,23.74 | v19.64,20.32 21.16,21.84 21.16,22 22.02,22.86 v25.91,22.86 | v27.15,21.95 26.76,21.55 C18.1
12GND
  Top 1.016: 12GND_3.1 42.39,4.37 39.8,1.78 35.59,1.78 R8.1
  Bottom 0.508: 12GND.1 48.01,2.26 12GND.2
  Bottom 1.016: OKI1.GND 38.81,10.95 40.45,12.6 42.25,12.6 43.41,11.44 43.41,8.13 | 48.01,2.26 45.52,2.26 12GND_3.1 43.41,8.13 | 12GND.1 12GND.2 12GND.3 12GND.4 58.55,2.26 58.98,1.83 61.8,1.83 12GND_4.1 | C23.2 43.31,8.23 43.41,8.13
BOOT0  (via drill 0.35)
  Top 0.152: IC1.94 62.23,23.62 63,23.62 63.83,24.44 v63.83,25.77 | v65.42,27.23 65.82,27.64 BOOT_SW.1
  Bottom 0.152: v65.42,27.23 65.29,27.23 v63.83,25.77
CTRL_SIG_MICRO  (via drill 0.35)
  Top 0.152: MUX.2 23.44,27.79 40.21,27.79 41.01,28.59 v42,28.59 | IC1.95 62.23,24.12 63,24.12 63.24,24.36 63.24,27.57 v60.34,30.46
  Bottom 0.152: v42,28.59 43.32,28.59 44.03,27.88 57.33,27.88 59.91,30.46 v60.34,30.46
CTRL_SIG_RADIO
  Bottom 0.152: RADIO_CONN.2 15.67,17.48 MUX.3
FLT_CTRL
  Top 0.152: MUX.4 23.8,20.02 23.8,8.19 23.77,8.16 23.77,6.47 23.8,6.44 FLT_CTRL_CONN.2
GIMBAL_X  (via drill 0.35)
  Top 0.152: v57.52,41.42 57.03,41.42 56.52,41.94 56.42,41.94 55.51,42.85 48.31,42.85 47.88,42.42 47.88,38.33 44.57,35.02 v44.57,34.4 | IC1.29 47.01,25.07 44.93,25.07 44.44,25.56 v44.44,28.8
  Bottom 0.152: GIM_CONN.4 58.37,41.42 v57.52,41.42 | v44.57,34.4 44.57,28.93 v44.44,28.8
GIMBAL_Y  (via drill 0.35)
  Top 0.152: IC1.30 44.18,24.6 43.78,25 v43.78,29.42 | v57.1,42.27 56.98,42.27 56.07,43.18 48.21,43.18 47.57,42.55 47.57,38.47 43.66,34.56 v43.54,34.56
  Bottom 0.152: v43.78,29.42 43.78,33.04 44.15,33.4 44.15,33.95 v43.54,34.56 | GIM_CONN.3 59.97,45.14 v57.1,42.27
GIMBAL_Z
  Bottom 0.152: C20.1 R4.1 55.6,41.77 57.43,43.6 GIM_CONN.2
GIMBAL_Z_PWM  (via drill 0.35)
  Top 0.152: v51.99,41.91 51.99,40.08 48.95,37.03 48.89,37.03 48.77,37.16 48.26,37.16 44.76,33.65 v43.54,33.65 | v43.15,30.08 43.15,24.9 43.94,24.11 IC1.31
  Bottom 0.152: v51.99,41.91 51.99,42.63 52.06,42.7 54.68,42.7 R4.2 | v43.54,33.65 43.13,33.25 43.13,30.09 v43.15,30.08
GND  (via drill 0.35)  (2 unrouted)
  Top 0.254: C25.2 22.75,6.01 FLT_CTRL_CONN.1 21.26,4.5 | C24.2 14.65,6.04 RADIO_CONN.1 14.35,3.3 20.06,3.3 21.26,4.5 | R8.2 29.98,3.83 29.45,3.3 22.46,3.3 21.26,4.5 | SWD.1 71.48,31.34 v69.14,29.01 | MICRO_USB.GND1 5.78,29.69 6.62,28.85 | UART.26 UART.25 6.76,28.71 6.62,28.85 | v10.25,31.46 8.44,33.27 UART.18 6.99,33.27 6.62,32.9 6.62,31.67 6.78,31.51 7.4,31.51 UART.21 7.57,31.29 6.91,31.29 6.62,31 6.62,28.85 | v12.6,31.45 13.38,30.66 UART.7 15.92,30.66 17.52,32.26 C16.2 C17.2 19.36,35.62 23.56,35.62 v27.89,31.29 | 57.96,37.76 51.62,37.76 50.59,36.73 C22.2 50.3,36.55 v48.51,36.55 | 57.96,37.76 C21.2 60.51,36.58 61.73,35.36 v61.75,35.33 | 57.96,37.76 57.96,40.6 C26.2 58.65,41.83 54.97,45.52 54.94,45.52 GIM_CONN.1 49.06,45.57 C27.2 48.44,43.91 47.22,42.69 47.22,40.56 RF_CONN.1 | v47.87,35.09 48.88,34.08 48.88,31.44 | IC1.20 51.11,29.21 48.88,31.44 | LED3.C 25.62,12.7 v25.15,12.7 | v52.86,15.11 54.71,15.11 v54.76,15.16 | v45.62,26.95 45.62,28.17 48.88,31.44
  Bottom 0.254: 53.56,18.59 D1.A 53.27,18.97 C11.2 53.25,20.47 C12.2 53.25,23.29 54.6,24.64 C9.2 55.03,25.55 55.57,25.01 55.57,24.69 55.73,24.52 56.06,24.52 C8.2 | 59.4,16.89 C4.2 C3.2 59.43,19.2 C2.2 59.43,23.27 C1.2 C8.2 | 24.37,13.47 24.86,13.96 C28.2 C18.2 27.66,23.48 27.66,29.22 28.72,30.28 28.72,31.25 28.68,31.29 | 24.37,13.47 MUX.8 21.29,10.39 21.29,4.47 21.26,4.5 FLT_CTRL_CONN.1 | C19.2 36.29,29.52 S3.1 44.32,25.04 47.18,25.04 | C19.2 34.99,30.79 34.88,30.79 34.37,31.29 28.68,31.29 | v10.25,31.46 12.58,31.46 v12.6,31.45 | v48.51,36.55 48.51,35.74 v47.87,35.09 | 28.68,31.29 v27.89,31.29 | C19.2 35.9,31.7 v36.42,31.7 | GIM_CONN.1 54.89,45.15 C20.2 | v69.14,29.01 69.14,29.04 62.84,35.33 v61.75,35.33 62.82,35.33 69.62,28.53 69.62,26.09 68.15,24.62 C29.2 | v25.15,12.7 24.37,13.47 | C8.2 C7.2 C6.2 C5.2 57.29,16.38 C14.2 55.92,15.16 v54.76,15.16 | v52.86,15.11 C15.2 50.07,16.71 48.72,16.71 47.31,18.13 47.31,19.26 47.34,19.29 C10.2 C13.2 47.34,23.68 47.18,23.84 47.18,25.04 | 47.18,25.04 47.18,25.42 R7.2 47.81,26.95 v45.62,26.95
  other vias: 29.46,6.6 54.61,39.88 49.02,40.13 4.32,35.31 17.53,23.37 44.96,21.08 64.26,12.95 46.23,30.73 9.4,24.13 32.44,15.8
  pour Top (isolate 0.305): 0,0 0,36.32 0,36.58 40.89,36.58 40.89,49.53 77.47,49.53 77.47,0
  pour Bottom (isolate 0.305): 0,0 0,36.58 40.89,36.58 40.89,49.53 77.47,49.53 77.47,0
MUX_EN  (via drill 0.35)
  Top 0.152: IC1.93 62.23,23.12 63.08,23.12 64.48,24.52 64.48,27.23 61.3,30.41 v61.25,30.41 | v42.49,27.8 40.66,27.8 40.32,27.46 30.73,27.46 MUX.15
  Bottom 0.152: v61.25,30.41 58.72,27.89 57.77,27.89 57.46,27.58 43.9,27.58 43.68,27.81 43.67,27.8 v42.49,27.8
N$1
  Top 0.152: R5.1 LED1.A
N$2
  Top 0.254: R10.1 33.82,6.64 LED3.A
N$4
  Top 0.152: LED2.A 15.65,17.03 R6.1
N$5  (via drill 0.35)
  Top 0.152: F1.1 17.47,27.29 16.44,26.26 12.34,26.26 v12.19,26.41 12.19,27.9 v12.3,28.02 | v11.86,29.29 11.48,29.66 11.48,32.95 8.52,35.92 6.68,35.92 5.42,34.66 5.42,32.47 5.24,32.29 MICRO_USB.VBUS1
  Bottom 0.152: v12.3,28.02 12.3,28.84 v11.86,29.29
N$6
  Top 0.152: R9.1 41.31,33.02 40.3,34.04 S3.3
  Bottom 0.152: C19.1 37.7,32.7 R3.1 39.28,34.04 S3.3
NRST  (via drill 0.35)
  Top 0.152: IC1.14 54.09,28.22 54.09,29.22 53.59,29.72 51.56,29.72 49.24,32.04 v49.24,35.88 49.18,35.94 47.8,35.94 44.88,33.02 43.52,33.02 43.01,32.51 R9.2
  Bottom 0.152: SWD.2 70.13,28.91 60.83,38.2 50.14,38.2 49.24,37.3 v49.24,35.88
OSC_IN
  Top 0.152: C21.1 57.25,36.57 X1.2 57.25,31.98 55.1,29.83 IC1.12
OSC_OUT
  Top 0.152: C22.1 52.38,32.88 X1.1 52.43,31.97 54.59,29.8 54.59,28.22 IC1.13
PD0  (via drill 0.35)
  Top 0.152: IC1.81 66.02,17.1 v66.14,17.23
  Bottom 0.152: v66.14,17.23 66.32,17.05 66.32,15.95 67.39,14.88 PD0-7.1
PD1  (via drill 0.35)
  Top 0.152: IC1.82 65.66,17.6 65.89,17.83 66.42,17.83 v66.62,18.03
  Bottom 0.152: v66.62,18.03 68.38,18.03 70.36,16.05 73.28,16.05 PD0-7.2
PD2  (via drill 0.35)
  Top 0.152: IC1.83 65.73,18.1 65.76,18.14 65.81,18.14 v66.62,18.94
  Bottom 0.152: v66.62,18.94 67.22,18.34 68.5,18.34 70.48,16.36 71.91,16.36 74.65,19.1 PD0-7.3
PD3  (via drill 0.35)
  Top 0.152: IC1.84 65.42,18.6 v65.71,18.89
  Bottom 0.152: v65.71,18.89 66.37,19.55 66.87,19.55 67.23,19.19 67.23,18.77 67.35,18.64 68.63,18.64 70.61,16.66 71.75,16.66 73.48,18.39 73.48,20.45 74.65,21.62 PD0-7.4
PD4  (via drill 0.35)
  Top 0.152: IC1.85 64.47,19.1 v66.62,21.24
  Bottom 0.152: v66.62,21.24 70.37,24.99 74.6,24.99 PD0-7.5
PD5  (via drill 0.35)
  Top 0.152: IC1.86 64.07,19.6 v66.62,22.15
  Bottom 0.152: v66.62,22.15 70.31,25.84 70.31,26.85 70.99,27.53 74.6,27.53 PD0-7.6
PD6  (via drill 0.35)
  Top 0.152: IC1.87 63.66,20.1 v66.62,23.06 | v70.28,27.68 72.2,27.68 PD0-7.7
  Bottom 0.152: v66.62,23.06 67.83,24.27 68.3,24.27 70,25.97 70,26.98 70.28,27.25 v70.28,27.68
PD7  (via drill 0.35)
  Top 0.152: IC1.88 62.33,20.72 63.1,20.72 66.62,24.24 v66.62,25.93 | PD0-7.8 73.74,32.66 72.64,31.57 72.64,30.96 71.96,30.28 71.19,30.28 70.31,29.39 70.31,29.23 v68.96,27.89
  Bottom 0.152: v66.62,25.93 67,25.93 v68.96,27.89
POW_IN
  Top 1.016: 12V_1.1 39.76,4.34 42.35,6.93 44.47,6.93 45.84,5.56 12POW.1
  Bottom 0.508: 12V_1.1 38.73,8.33
  Bottom 1.016: OKI1.VIN 38.73,8.33 | 38.73,8.33 12V_1.1 | 12V_2.1 56.46,4.39 12POW.4 12POW.3 12POW.2 12POW.1 | C23.1 38.84,8.23 38.73,8.33
RF_CE  (via drill 0.35)
  Top 0.152: v47.24,34.38 48.03,33.59 v48.03,33.15 | v57.68,29.67 57.61,29.6 IC1.7
  Bottom 0.152: v57.68,29.67 57.07,30.28 50.42,30.28 48.03,32.66 v48.03,33.15 | RF_CONN.3 47.24,39.32 v47.24,34.38
RF_CSN  (via drill 0.35)
  Top 0.152: v56.77,29.67 57.11,29.33 IC1.8
  Bottom 0.152: v56.77,29.67 56.77,29.58 56.12,28.92 50.91,28.92 41.63,38.2 41.63,39.17 42.8,40.34 RF_CONN.4
RF_IRQ  (via drill 0.35)
  Top 0.152: v55.71,29.53 56.05,29.53 56.61,28.97 IC1.9
  Bottom 0.152: v55.71,29.53 50.73,29.53 43.56,36.7 43.56,37.79 43.97,38.2 43.97,45.14 RF_CONN.8
RF_MISO  (via drill 0.35)
  Top 0.152: IC1.79 66.82,16.09 v66.93,16.2 | v66.83,33.07 67.94,31.95 67.94,22.53 68.28,22.2 v68.28,17.25
  Bottom 0.152: v66.83,33.07 61.21,38.68 52.96,38.68 RF_CONN.7 | v68.28,17.25 67.97,17.25 v66.93,16.2
RF_MOSI  (via drill 0.35)
  Top 0.152: IC1.80 62.23,16.62 66.46,16.62 67.33,17.49 67.33,29.99 63.54,33.78 v60.63,33.78 | v60.63,33.78 | RF_CONN.6 42.8,42.88 41.63,41.71 41.63,38.2 42.31,37.52 44.02,37.52 v44.2,37.34
  Bottom 0.152: v60.63,33.78 v60.62,33.77 46.96,33.77 44.17,36.56 44.17,37.31 v44.2,37.34
RF_SCK  (via drill 0.35)
  Top 0.152: v63.04,37.71 63.04,36 67.64,31.4 67.64,15.98 67.25,15.59 IC1.78 | v49.53,41.15 v51.31,41.15
  Bottom 0.152: RF_CONN.5 47.95,41.15 v49.53,41.15 | v51.31,41.15 51.72,40.75 59.86,40.75 62.89,37.71 v63.04,37.71
RXD  (via drill 0.35)
  Top 0.152: v16.86,27.54 16.73,27.54 15.84,28.44 15.84,28.98 15.7,29.12 15.16,29.12 UART.5 | v25.76,25.68 29.33,25.68 29.56,25.45 35.76,25.45 44.02,17.2 44.45,17.2 v45.12,16.52 | v57.1,11.25 57.1,12.99 IC1.68
  Bottom 0.152: v16.86,27.54 18.86,25.55 25.64,25.55 v25.76,25.68 | v45.12,16.52 45.73,15.91 46.08,15.91 50.74,11.25 v57.1,11.25
RXLED  (via drill 0.35)
  Top 0.152: v9.14,30.32 9.14,30.34 8.79,30.7 7.63,30.7 UART.22 | v14.38,17.09 14.38,16.35 15.55,15.18 LED2.C
  Bottom 0.152: v14.38,17.09 14.38,18.33 15.27,19.23 15.27,24.19 v9.14,30.32
SIG_SEL  (via drill 0.35)
  Top 0.152: IC1.92 62.24,22.57 63,22.57 64.81,24.37 64.81,28.88 63.26,30.43 v62.16,30.43 | v41.35,29.23 41.22,29.23 40.08,28.09 23.34,28.09 MUX.1
  Bottom 0.152: v41.35,29.23 43.12,29.23 44.16,28.19 54.1,28.19 57.08,28.19 59.96,31.07 61.45,31.07 62.09,30.43 v62.16,30.43
T_SWO  (via drill 0.35)
  Top 0.152: v65.68,25.81 65.17,25.3 65.17,23.29 63,21.12 62.23,21.12 IC1.89 | v68.96,26.36 SWD.3
  Bottom 0.152: v65.68,25.81 65.88,25.81 66.67,25.02 67.62,25.02 v68.96,26.36
TCK/SWCLK
  Top 0.152: IC1.72 59.23,12.88 59.23,12.11 59.52,11.82 66.2,11.82 72.64,18.26 72.64,19.23 71.48,20.4 SWD.5
TMS/SWDIO  (via drill 0.35)
  Top 0.152: IC1.76 66.72,14.6 69.93,17.81 v69.93,20.17
  Bottom 0.152: v69.93,20.17 70.31,20.55 70.31,21.77 71.48,22.94 SWD.4
TXD  (via drill 0.35)
  Top 0.152: UART.1 16.08,26.76 v16.19,26.87 | v26.44,25.07 29.38,25.07 29.45,25.15 35.64,25.15 v45.17,15.61 | v57.63,10.34 57.61,10.36 57.61,10.94 57.68,11.01 57.68,11.49 57.61,11.56 IC1.69
  Bottom 0.152: v16.19,26.87 17.99,25.07 21.76,25.07 21.83,25.15 22.72,25.15 22.79,25.07 v26.44,25.07 | v45.17,15.61 45.95,15.61 47.09,14.47 51.22,10.34 v57.63,10.34
TXLED  (via drill 0.35)
  Top 0.152: v8.87,27.96 8.52,27.61 8.52,26.49 4.61,22.58 4.61,16.65 LED1.C | v8.97,29.41 8.89,29.41 8.28,30.01 UART.23
  Bottom 0.152: v8.87,27.96 8.87,29.31 v8.97,29.41
USB_D+
  Top 0.152: MICRO_USB.D+1 5.37,30.98 6.03,31.64 6.03,34.2 7.06,35.22 7.54,35.22 7.54,35.21 UART.15
USB_D-
  Top 0.152: UART.16 7.84,34.81 8.39,34.81 8.52,34.94 8.52,35.48 8.39,35.62 6.8,35.62 5.72,34.54 5.72,31.9 5.47,31.65 4.49,31.65 4.48,31.64 MICRO_USB.D-1
VBAT  (via drill 0.35)
  Top 0.152: IC1.6 58.11,27.34 58.62,26.82 v58.62,26.7
  Bottom 0.152: v58.62,26.7 58.62,25.39 R2.2 58.44,25.55 C9.1
VCAP_1  (via drill 0.35)
  Top 0.152: v48.36,15.09 47.02,15.09 IC1.49
  Bottom 0.152: C15.1 49.75,15.09 v48.36,15.09
VCAP_2  (via drill 0.35)
  Top 0.152: v59.61,15.11 IC1.73
  Bottom 0.152: C14.1 59.59,15.09 v59.61,15.11
VCC  (via drill 0.35)
  Top 0.254: F1.2 20.27,32.21 C16.1 C17.1 19.29,33.66 19.29,31.29 19.14,31.14 17.35,31.14 v17.19,30.99 | v8.86,31.92 7.64,31.92 UART.20
  Bottom 0.254: v17.19,30.99 16.36,30.15 10.63,30.15 v8.86,31.92
VDD  (via drill 0.35)
  Top 0.152: 15.65,21.23 R6.2
  Top 0.254: IC1.11 55.68,28.13 55.54,27.99 55.54,27.28 55.38,27.12 52.86,27.12 | C25.1 24.65,6.17 26.3,4.52 FLT_CTRL_CONN.3 30.09,4.52 30.79,5.22 35.42,5.22 36.31,6.11 | 36.31,6.11 41,10.79 OKI1.VOUT 41.35,11.99 43.96,14.6 IC1.50 47.96,14.6 48.1,14.46 48.95,14.46 v51.66,17.17 | C24.1 16.55,6.19 RADIO_CONN.3 | v39.14,30.89 43.28,30.89 45.13,29.04 45.13,28.22 44.8,27.89 44.8,25.95 45.16,25.6 IC1.28 50.14,25.6 50.34,25.4 52.64,25.4 v53.54,24.5 | RF_CONN.2 44.02,39.9 45.84,39.9 45.86,39.89 45.97,39.89 46.81,40.73 46.81,45.12 48.44,46.74 C27.1 63.77,46.85 GIM_CONN.5 61.37,41.88 61.15,41.88 C26.1 62.19,41.83 66.55,37.48 BOOT_SW.2 68.3,34.87 68.3,22.74 71.48,19.56 SWD.6 66.9,14.17 61.78,14.17 IC1.75 | R10.2 36.24,6.11 36.31,6.11 | MUX.16 25.45,29.16 v25.4,29.21 | v13.46,28.7 13.47,28.71 UART.4 | IC1.19 51.68,28.13 51.68,27.28 51.84,27.12 52.86,27.12 | IC1.100 60.56,26.6 v60.48,26.68 | v52.88,26.42 52.86,26.44 52.86,27.12 | 15.12,21.23 15.65,21.23 | v14.21,20.32 14.96,21.07 R6.2 15.86,21.28 v15.86,22.99 | v13.29,17.67 8.12,17.67 7.47,18.32 7.47,18.41 7.47,18.59 7.47,19.94 R5.2
  Bottom 0.254: RADIO_CONN.3 19.43,3.3 25.12,3.3 FLT_CTRL_CONN.3 26.64,4.52 26.64,18.53 C28.1 28.07,19.95 28.07,28 29.23,29.16 MUX.16 | R3.2 37.81,30.89 v39.14,30.89 | SWD.6 71.2,19.02 67.91,19.02 65.33,21.61 C29.1 62.68,25.38 R2.1 | v25.4,29.21 24.38,29.21 23.39,28.22 23.39,28.2 23.23,28.04 23.22,28.04 23.11,27.94 17.36,27.94 17.13,28.18 16.6,28.18 16.37,27.94 14.22,27.94 | 14.22,27.94 v13.46,28.7 | R2.1 60.51,24.08 C1.1 61.33,23.27 C2.1 61.33,19.2 C3.1 C4.1 60.25,16.07 60.25,14.85 59.45,14.06 54.65,14.06 53.98,14.73 53.98,15.88 55.22,17.12 | 55.22,17.12 C5.1 51.62,17.12 | L1.1 48.47,18.24 48.47,18.13 49.48,17.12 51.62,17.12 | v51.66,17.17 51.62,17.12 | R2.1 60.51,26.64 v60.48,26.68 59.53,26.68 58.88,27.33 58.36,27.33 57.72,26.68 53.15,26.68 v52.88,26.42 52.88,26.39 53.31,25.96 53.31,24.72 v53.54,24.5 | C8.1 C7.1 C6.1 55.39,17.29 55.22,17.12 | v14.21,20.32 14.21,18.67 14.02,18.48 14.02,18.41 v13.29,17.67 | v15.86,22.99 15.86,26.31 14.22,27.94
VDDA  (via drill 0.35)
  Top 0.152: v50.62,26.44 50.62,26.9 50.11,27.41 IC1.22
  Bottom 0.152: v50.62,26.44 50.48,26.3 R1.1 49.23,23.8 C13.1 C10.1 49.23,18.76 L1.2
VREF+  (via drill 0.35)
  Top 0.152: IC1.21 50.73,28.08 50.73,27.28 51.53,26.48 v51.53,26.41
  Bottom 0.152: v51.53,26.41 52.38,25.56 R1.2 51.35,24.01 C12.1 51.35,20.47 C11.1 51.37,18.61 D1.C
VSS  (via drill 0.35)
  Top 0.152: IC1.27 49.41,26.1 v49.76,26.45 49.79,26.45 50.49,25.75 54.62,25.75 55.03,26.17 56.04,27.18 56.04,28.13 IC1.10 56.23,28.08 56.23,27.3 57.44,26.1 IC1.99 62.09,25.98 61.31,25.98 60.2,24.86 60.2,14.87 60.11,14.79 IC1.74
  Bottom 0.152: R7.1 49.63,25.97 49.63,26.24 49.76,26.38 v49.76,26.45

### Text on the board
tPlace: 030719 V1.1 on-drone / ECE477 Group 17 / Haobo Chen / Xufei Gao / Yi Qiao / Xingchen Wang